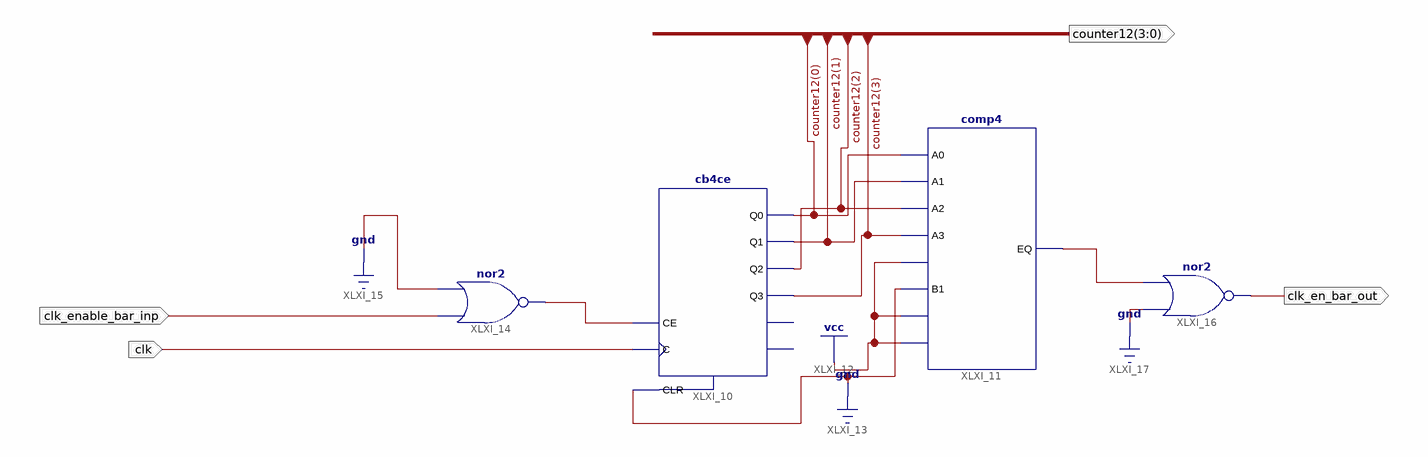
[diagram p0: schematic sheet 1]
// Xilinx ISE schematic iteration.sch (spartan3) as structural Verilog: 4 symbols, 4 ports
module iteration (
  input  clk,
  input  clk_enable_bar_inp,
  output [3:0] counter12,
  output clk_en_bar_out
);

  wire XLXN_35, XLXN_51;

  cb4ce XLXI_10 (
    .C(clk), .CE(XLXN_51), .CLR(1'b0), .Q0(counter12[0]), .Q1(counter12[1]), .Q2(counter12[2]),
    .Q3(counter12[3]));  // open: CEO, TC
  comp4 XLXI_11 (
    .A0(counter12[0]), .A1(counter12[1]), .A2(counter12[2]), .A3(counter12[3]), .B0(1'b1), .B1(1'b0),
    .B2(1'b1), .B3(1'b1), .EQ(XLXN_35));
  nor XLXI_14 (XLXN_51, clk_enable_bar_inp, 1'b0);
  nor XLXI_16 (clk_en_bar_out, 1'b0, XLXN_35);
endmodule
